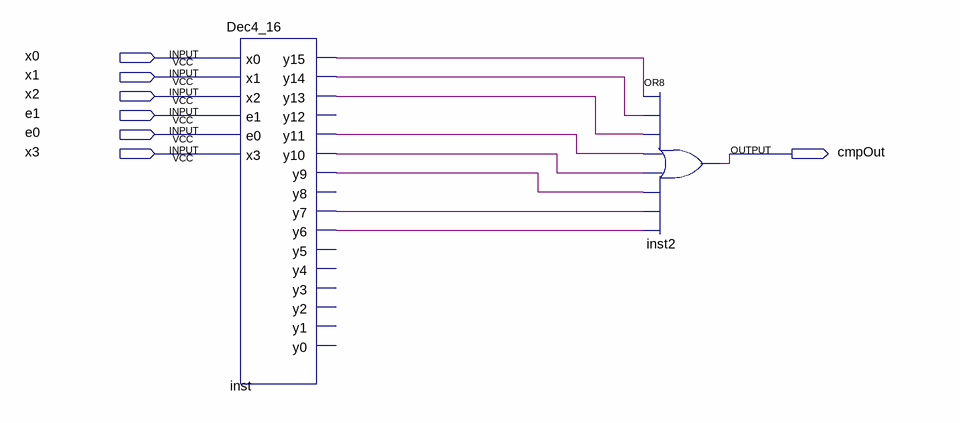
[diagram p0: schematic sheet]
// Quartus schematic DecoderDemo3.bdf as structural Verilog: 2 symbols, 7 pins
module DecoderDemo3 (
  input  x0,
  input  x1,
  input  x2,
  input  e1,
  input  e0,
  input  x3,
  output cmpOut
);

  wire inst_y6, inst_y7, inst_y9, inst_y10, inst_y11, inst_y13, inst_y14, inst_y15;

  Dec4_16 inst (
    .x0(x0), .x1(x1), .x2(x2), .e1(e1), .e0(e0), .x3(x3), .y15(inst_y15), .y14(inst_y14), .y13(inst_y13),
    .y11(inst_y11), .y10(inst_y10), .y9(inst_y9), .y7(inst_y7), .y6(inst_y6));  // open: y12, y8, y5, y4, y3, y2, y1, y0
  or inst2 (cmpOut, inst_y15, inst_y14, inst_y13, inst_y11, inst_y10, inst_y9, inst_y7, inst_y6);
endmodule
